# Altium schematic sheet topvent.SchDoc: Sheet Title
size Legal; Organization: Stanford SSI; Address1: L3, 12a Rodborough Rd; Address2: Frenchs Forest; Address3: NSW; Address4: Australia 2086; SheetNumber: n; SheetTotal: m
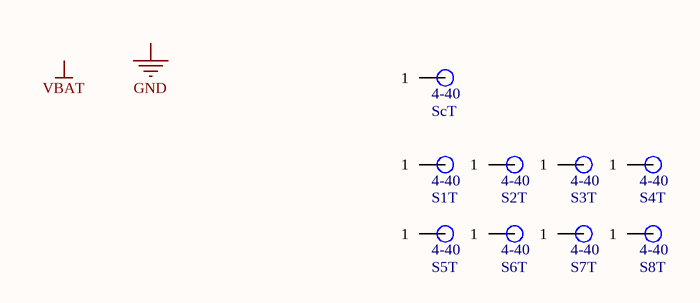
[diagram p0: topvent.SchDoc]

## Parts
S1T  4-40 Machine screw  [SCREW_4-40]  (value not drawn)
S2T  4-40 Machine screw  [SCREW_4-40]  (value not drawn)
S3T  4-40 Machine screw  [SCREW_4-40]  (value not drawn)
S4T  4-40 Machine screw  [SCREW_4-40]  (value not drawn)
S5T  4-40 Machine screw  [SCREW_4-40]  (value not drawn)
S6T  4-40 Machine screw  [SCREW_4-40]  (value not drawn)
S7T  4-40 Machine screw  [SCREW_4-40]  (value not drawn)
S8T  4-40 Machine screw  [SCREW_4-40]  (value not drawn)
ScT  4-40 Machine screw  [SCREW_4-40]  (value not drawn)

## Nets

Not connected (* = marked no-connect by the designer): S1T 1; S2T 1; S3T 1; S4T 1; S5T 1; S6T 1; S7T 1; S8T 1; ScT 1

## Notes on the sheet
- Labels drawn without touching a wire or pin: GND, VBAT
- PROJECT
- SHEET
- Powered By
- Sheet
- of
- REVISION
- ssi.stanford.edu
- ENGINEER
- REVIEWER
- REVIEWED ON
- (in symbol SCREW_4-40) 4-40

## Library data of the parts
S1T S2T S3T S4T S5T S6T S7T S8T ScT = SCREW_4-40: Supplier 1: Digi-Key